# Altium schematic sheet 01_TOP LEVEL.SchDoc
size 420 x 297 mm
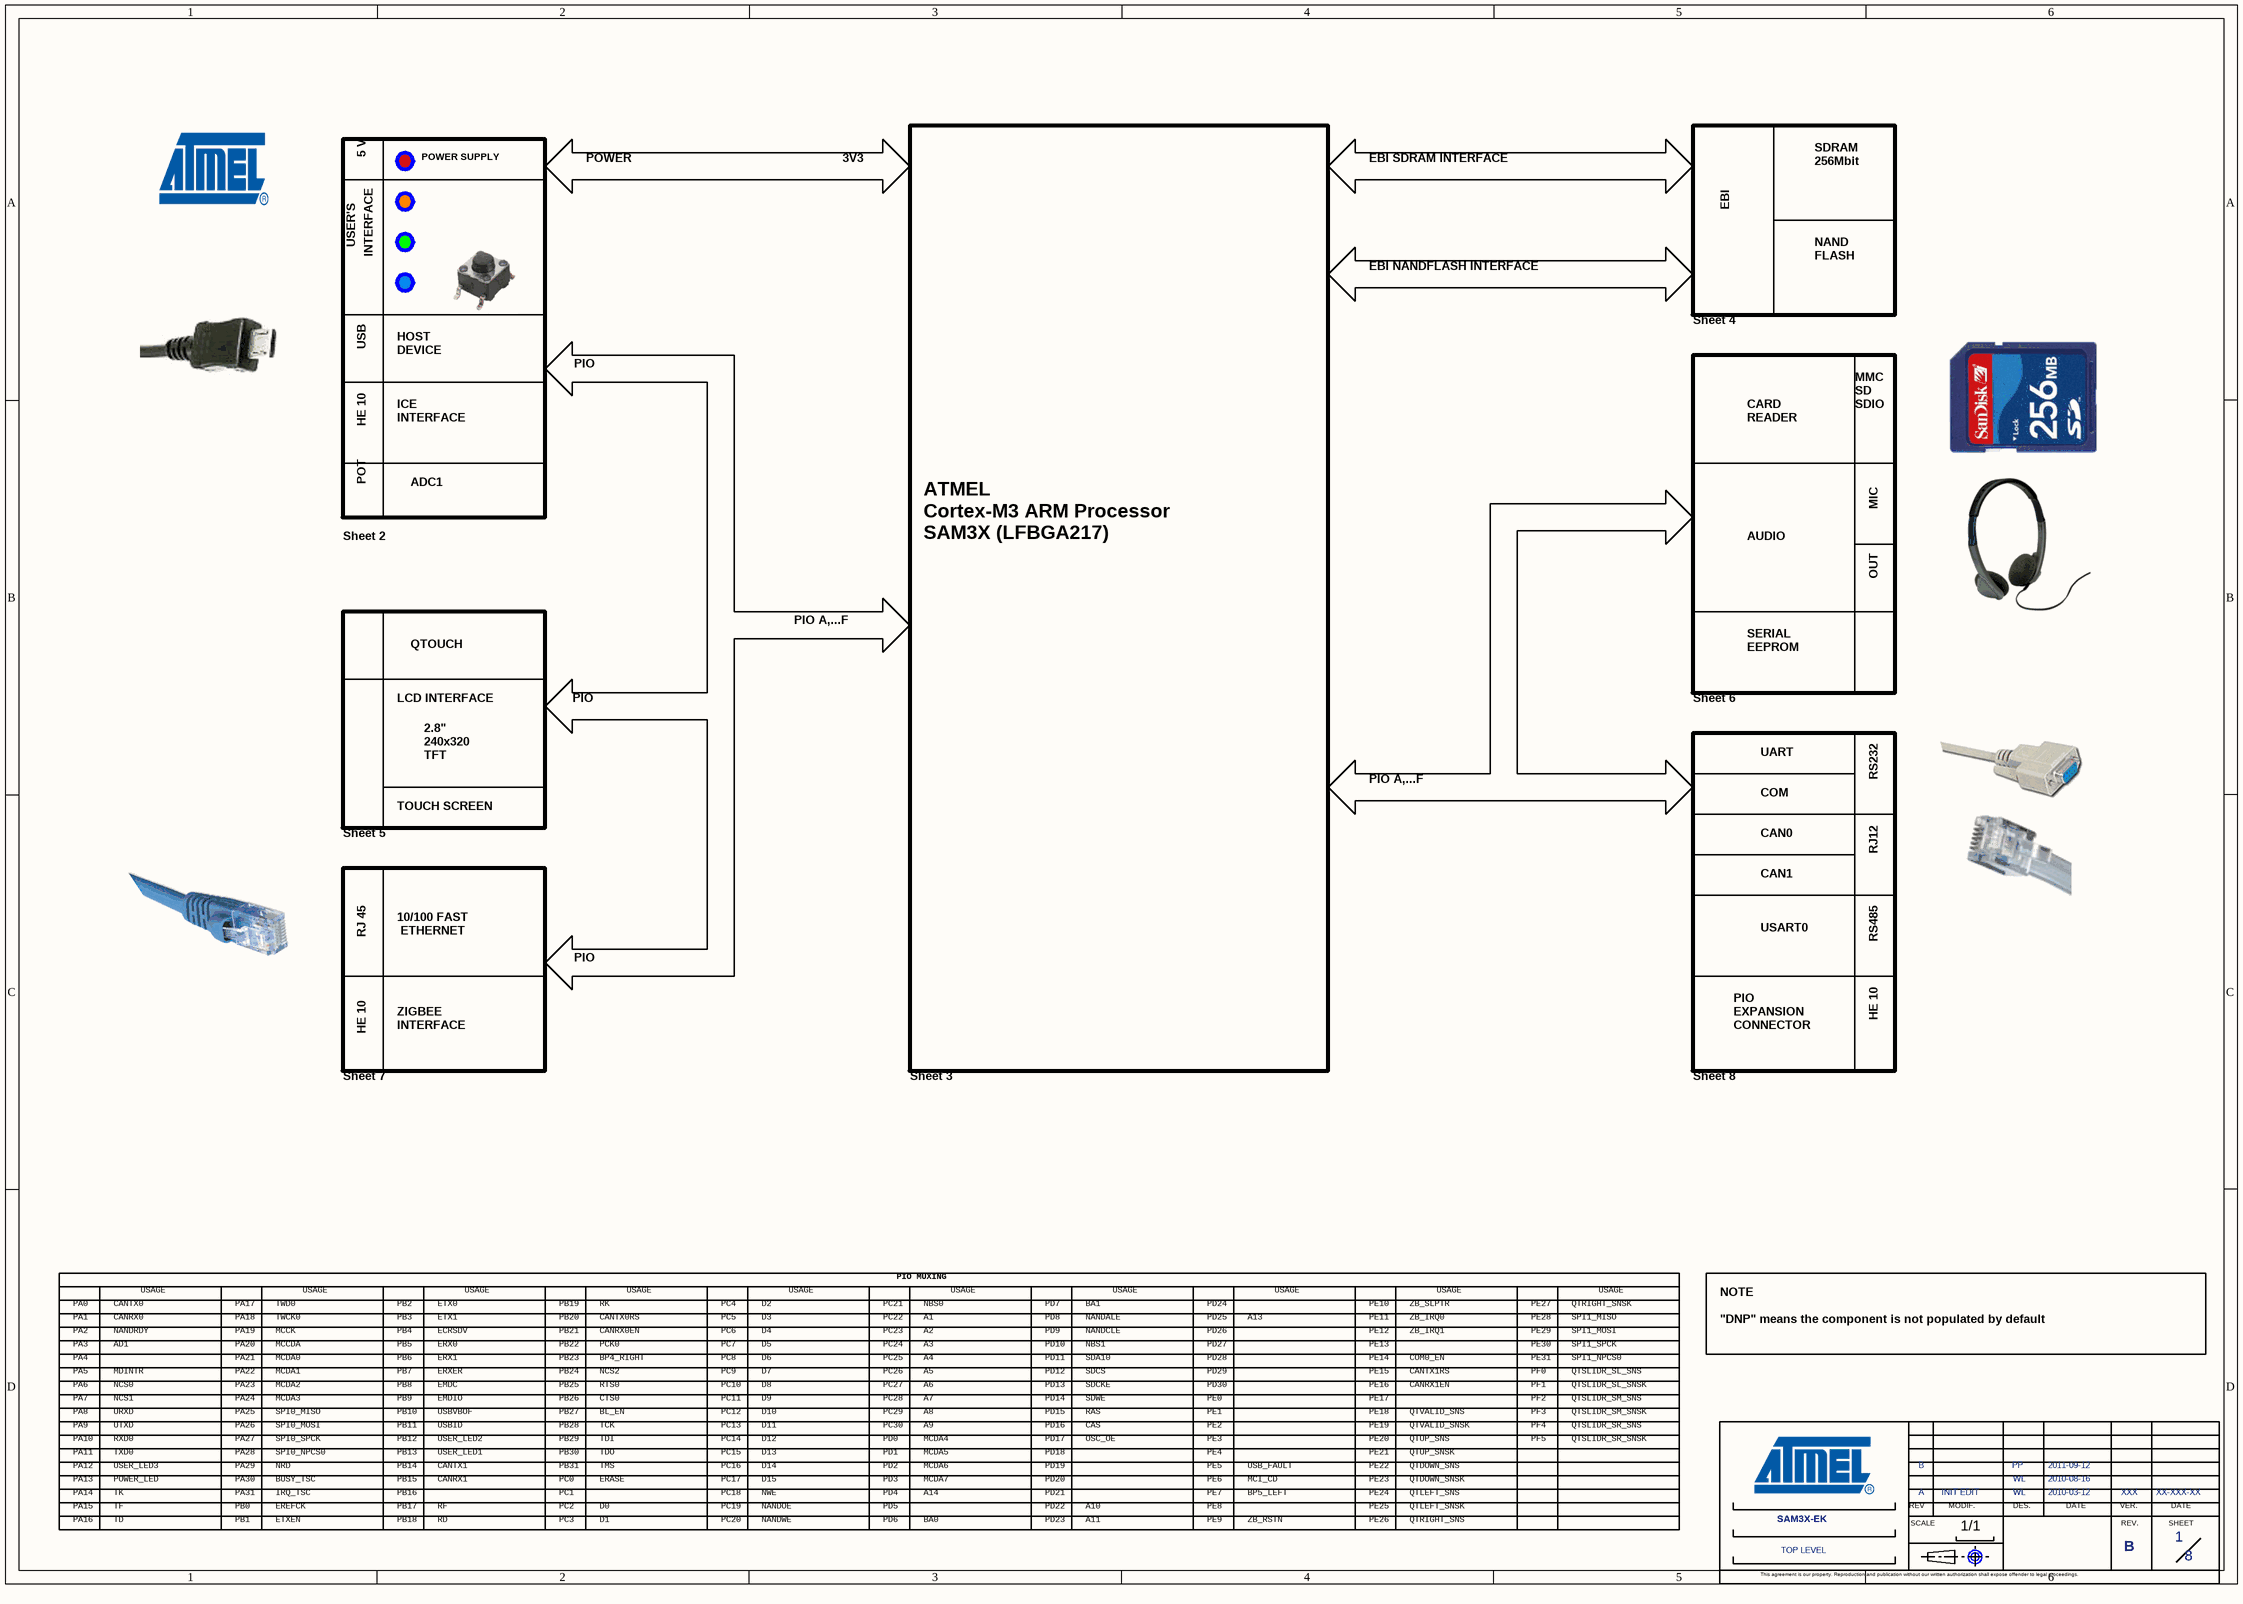
[diagram p0: 01_TOP LEVEL.SchDoc]

## Parts
*  SHEET NAME 1: TOP LEVEL  REV C: B  VERIF A: XXX  VERIF DATE A: XX-XXX-XX  Page Count: 8  Page Number: 1  DATE A: 2010-03-12  DATE B: 2010-08-16  DATE C: 2011-09-12  DES A: WL  DES C: PP  BOARD NAME: SAM3X-EK  VERSION: A  MODIF. DESCRIBE: INIT EDIT  (hidden comment: ATMEL ARM)  (graphical)

## Notes on the sheet
- 5 V
- POWER SUPPLY
- POWER
- 3V3
- EBI SDRAM INTERFACE
- SDRAM
  256Mbit
- USER'S
- INTERFACE
- EBI
- NAND
  FLASH
- HOST
  DEVICE
- EBI NANDFLASH INTERFACE
- Sheet 4
- USB
- ICE
  INTERFACE
- PIO
- CARD
  READER
- MMC SD
  SDIO
- HE 10
- POT
- ADC1
- ATMEL
  Cortex-M3 ARM Processor
  SAM3X (LFBGA217)
- MIC
- Sheet 2
- AUDIO
- OUT
- QTOUCH
- PIO A,...F
- SERIAL
  EEPROM
- LCD INTERFACE
- 2.8"
  240x320
  TFT
- Sheet 6
- UART
- COM
- RS232
- Sheet 5
- TOUCH SCREEN
- CAN0
- RJ12
- RJ 45
- 10/100 FAST
  ETHERNET
- CAN1
- USART0
- RS485
- ZIGBEE
  INTERFACE
- PIO
  EXPANSION
  CONNECTOR
- Sheet 7
- Sheet 3
- Sheet 8
- PA0
- PA1
- PA2
- NANDRDY
- CANTX0
- CANRX0
- USAGE
- PA17
- PA18
- PA19
- MCCK
- TWD0
- TWCK0
- PB2
- PB3
- PB4
- ETX0
- ETX1
- ECRSDV
- PB19
- PB20
- PB21
- RK
- CANTX0RS
- CANRX0EN
- PC4
- PC5
- PC6
- D2
- D3
- D4
- PC21
- PC22
- PC23
- PIO MUXING
- A1
- A2
- NBS0
- PD7
- PD8
- PD9
- NANDALE
- NANDCLE
- BA1
- PD24
- PD25
- PD26
- A13
- PE10
- PE11
- PE12
- ZB_SLPTR
- ZB_IRQ0
- ZB_IRQ1
- PE27
- PE28
- PE29
- SPI1_MISO
- SPI1_MOSI
- QTRIGHT_SNSK
- "DNP" means the component is not populated by default
- NOTE
- PA3
- PA4
- PA5
- PA6
- PA7
- NCS1
- NCS0
- MDINTR
- AD1
- PA20
- PA21
- PA22
- PA23
- PA24
- MCCDA
- MCDA0
- MCDA2
- MCDA1
- MCDA3
- PB5
- PB6
- PB7
- PB8
- PB9
- ERX0
- ERX1
- ERXER
- EMDC
- EMDIO
- PB22
- PB23
- PB24
- PB25
- PB26
- PCK0
- NCS2
- RTS0
- CTS0
- BP4_RIGHT
- PC7
- PC8
- PC9
- PC10
- PC11
- D5
- D6
- D7
- D8
- D9
- PC24
- PC25
- PC26
- PC27
- PC28
- A3
- A4
- A5
- A6
- A7
- PD10
- PD11
- PD12
- PD13
- PD14
- SDA10
- SDCKE
- NBS1
- SDWE
- SDCS
- PE0
- PD27
- PD28
- PD29
- PD30
- PE13
- PE14
- PE15
- PE16
- PE17
- COM0_EN
- CANTX1RS
- CANRX1EN
- PE30
- PE31
- PF0
- PF1
- PF2
- SPI1_SPCK
- SPI1_NPCS0
- QTSLIDR_SL_SNS
- QTSLIDR_SL_SNSK
- QTSLIDR_SM_SNS
- PA8
- PA9
- PA10
- PA11
- PA12
- URXD
- UTXD
- RXD0
- TXD0
- USER_LED3
- PA25
- PA26
- PA27
- PA28
- PA29
- SPI0_MISO
- SPI0_MOSI
- SPI0_SPCK
- SPI0_NPCS0
- NRD
- PB10
- PB11
- PB12
- PB13
- PB14
- USBVBOF
- USBID
- CANTX1
- USER_LED1
- USER_LED2
- PB27
- PB28
- PB29
- PB30
- PB31
- TCK
- TDI
- TDO
- TMS
- BL_EN
- PC12
- PC13
- PC14
- PC15
- PC16
- D10
- D11
- D12
- D13
- D14
- PD0
- PD1
- PD2
- PC29
- PC30
- MCDA4
- MCDA5
- MCDA6
- A8
- A9
- PD15
- PD16
- PD17
- PD18
- PD19
- CAS
- RAS
- OSC_OE
- PE1
- PE2
- PE3
- PE4
- PE5
- USB_FAULT
- PE18
- PE19
- PE20
- PE21
- PE22
- QTVALID_SNS
- QTVALID_SNSK
- QTUP_SNS
- QTUP_SNSK
- QTDOWN_SNS
- PF3
- PF4
- PF5
- QTSLIDR_SM_SNSK
- QTSLIDR_SR_SNS
- QTSLIDR_SR_SNSK
- PA13
- PA14
- PA15
- PA16
- TK
- TF
- TD
- POWER_LED
- PB0
- PB1
- PA30
- PA31
- EREFCK
- ETXEN
- IRQ_TSC
- BUSY_TSC
- PB15
- PB16
- PB17
- PB18
- RF
- RD
- CANRX1
- PC0
- PC1
- PC2
- PC3
- D0
- D1
- ERASE
- PC17
- PC18
- PC19
- PC20
- NWE
- D15
- NANDOE
- NANDWE
- PD3
- PD4
- PD5
- PD6
- MCDA7
- A14
- BA0
- PD20
- PD21
- PD22
- PD23
- A10
- A11
- PE6
- PE7
- PE8
- PE9
- ZB_RSTN
- BP5_LEFT
- MCI_CD
- PE23
- PE24
- PE25
- PE26
- QTDOWN_SNSK
- QTLEFT_SNS
- QTLEFT_SNSK
- QTRIGHT_SNS
- (in symbol ATMEL ARM) REV; MODIF.; DES.; DATE; VER.; SCALE; REV.; SHEET; 1/1; This agreement is our property. Reproduction and publication without our written authorization shall expose offender to legal proceedings.

## Library data of the parts
* = ATMEL ARM: REV D: D; REV F: F; REV E: E; REV B: B; VERIF F: XXX; VERIF E: XXX; VERIF D: XXX; VERIF C: XXX; VERIF B: XXX; VERIF DATE F: XX-XXX-XX; VERIF DATE E: XX-XXX-XX; VERIF DATE D: XX-XXX-XX; VERIF DATE C: XX-XXX-XX; REV: B; VERIF DATE B: XX-XXX-XX; FT: ?; Page Size: A; Page Create Date: june 19, 2004; DATE D: XX-XXX-XX; DATE E: XX-XXX-XX; DATE F: XX-XXX-XX; DES E: XXX; DES F: XXX; DES B: WL; DES D: XXX